# Altium schematic sheet CFD_V1.03_Main.SchDoc: ALICE FIT CFD Mezzanine
size 420 x 297 mm; CheckedBy: G.Kasprowicz; Author: INR Moscow; CompanyName: WUT ISE; DrawnBy: Maciej Podgóski; Organization: WUT ISE; Address1: PW ISE; Address2: Nowowiejska 15/19 00-665 Warsaw; Address3: gkasprow@gmail.com; DocumentNumber: 1; Revision: 2; SheetNumber: 1; SheetTotal: 5; ModifiedBy: -; CheckedDate: -; Title2: Top entity; DivGrp: WUT ISE; Designer: INR Moscow; ModifiedDate: -; ProjectName: Sensor Box
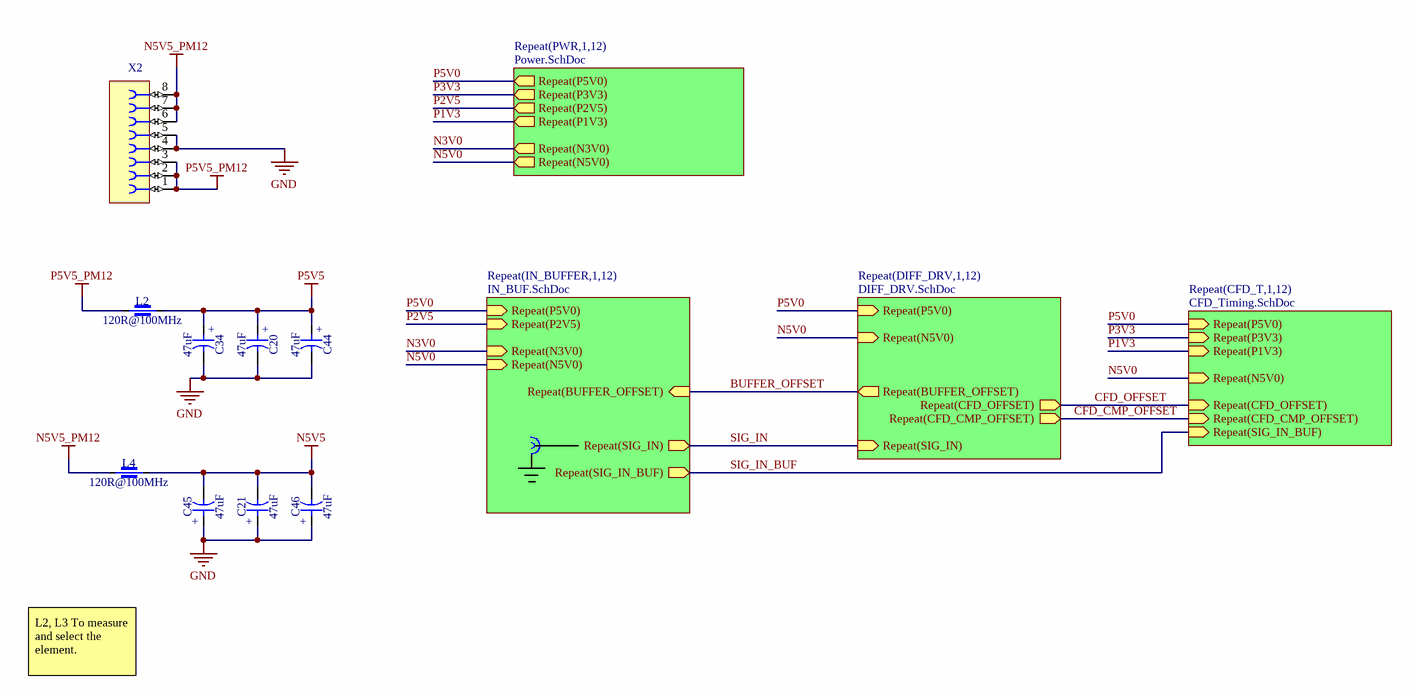
[diagram p0: CFD_V1.03_Main.SchDoc]

## Parts
C20  47uF  [CAPAE530X610N]
C21  47uF  [CAPAE530X610N]
C34  47uF  [CAPAE530X610N]
C44  47uF  [CAPAE530X610N]
C45  47uF  [CAPAE530X610N]
C46  47uF  [CAPAE530X610N]
L2  120R@100MHz  [IND_MURATA_BLM31KN]
L4  120R@100MHz  [IND_MURATA_BLM31KN]
X2  Socket 8  [SAMTEC_CES-108-01-T-S]  (value not drawn)

## Sub-sheets
Repeat(CFD_T,1,12) = CFD_Timing.SchDoc: Repeat(SIG_IN_BUF) (in), Repeat(CFD_CMP_OFFSET) (in), Repeat(P5V0) (in), Repeat(P3V3) (in), Repeat(P1V3) (in), Repeat(N5V0) (in), Repeat(CFD_OFFSET) (in)
Repeat(DIFF_DRV,1,12) = DIFF_DRV.SchDoc: Repeat(SIG_IN) (in), Repeat(BUFFER_OFFSET) (out), Repeat(CFD_CMP_OFFSET) (out), Repeat(P5V0) (in), Repeat(N5V0) (in), Repeat(CFD_OFFSET) (out)
Repeat(IN_BUFFER,1,12) = IN_BUF.SchDoc: Repeat(SIG_IN_BUF) (out), Repeat(SIG_IN) (out), Repeat(BUFFER_OFFSET) (in), Repeat(P5V0) (in), Repeat(P2V5) (in), Repeat(N5V0) (in), Repeat(N3V0) (in)
Repeat(PWR,1,12) = Power.SchDoc: Repeat(P5V0) (out), Repeat(P3V3) (out), Repeat(P2V5) (out), Repeat(P1V3) (out), Repeat(N3V0) (out), Repeat(N5V0) (out)

## Nets
GND: C20.2 C21.1 C34.2 C44.2 C45.1 C46.1 X2.4 X2.5
N5V5: C21.2 C45.2 C46.2 L4.2
N5V5_PM12: L4.1 X2.6 X2.7 X2.8
P5V5: C20.1 C34.1 C44.1 L2.2
P5V5_PM12: L2.1 X2.1 X2.2 X2.3
BUFFER_OFFSET: sheet Repeat(IN_BUFFER,1,12)/Repeat(BUFFER_OFFSET), sheet Repeat(DIFF_DRV,1,12)/Repeat(BUFFER_OFFSET)
CFD_CMP_OFFSET: sheet Repeat(DIFF_DRV,1,12)/Repeat(CFD_CMP_OFFSET), sheet Repeat(CFD_T,1,12)/Repeat(CFD_CMP_OFFSET)
CFD_OFFSET: sheet Repeat(DIFF_DRV,1,12)/Repeat(CFD_OFFSET), sheet Repeat(CFD_T,1,12)/Repeat(CFD_OFFSET)
N3V0: sheet Repeat(PWR,1,12)/Repeat(N3V0), sheet Repeat(IN_BUFFER,1,12)/Repeat(N3V0)
N5V0: sheet Repeat(PWR,1,12)/Repeat(N5V0), sheet Repeat(IN_BUFFER,1,12)/Repeat(N5V0), sheet Repeat(DIFF_DRV,1,12)/Repeat(N5V0), sheet Repeat(CFD_T,1,12)/Repeat(N5V0)
P1V3: sheet Repeat(PWR,1,12)/Repeat(P1V3), sheet Repeat(CFD_T,1,12)/Repeat(P1V3)
P2V5: sheet Repeat(PWR,1,12)/Repeat(P2V5), sheet Repeat(IN_BUFFER,1,12)/Repeat(P2V5)
P3V3: sheet Repeat(PWR,1,12)/Repeat(P3V3), sheet Repeat(CFD_T,1,12)/Repeat(P3V3)
P5V0: sheet Repeat(PWR,1,12)/Repeat(P5V0), sheet Repeat(IN_BUFFER,1,12)/Repeat(P5V0), sheet Repeat(DIFF_DRV,1,12)/Repeat(P5V0), sheet Repeat(CFD_T,1,12)/Repeat(P5V0)
SIG_IN: sheet Repeat(IN_BUFFER,1,12)/Repeat(SIG_IN), sheet Repeat(DIFF_DRV,1,12)/Repeat(SIG_IN)
SIG_IN_BUF: sheet Repeat(IN_BUFFER,1,12)/Repeat(SIG_IN_BUF), sheet Repeat(CFD_T,1,12)/Repeat(SIG_IN_BUF)

## Notes on the sheet
- L2, L3 To measure and select the element.
- Project/Equipment
- Document
- Designer
- Drawn by
- Check.by
- Copyright WUT ISE 2024.
  This documentation describes Open Hardware and is licensed under the CERN OHL v.2. You may redistribute and modify this documentation under the terms of the CERN OHL v.2. (http://ohwr.org/CERNOHL). This documentation is distributed WITHOUT ANY EXPRESS OR IMPLIED WARRANTY, INCLUDING OF MERCHANTABILITY, SATISFACTORY QUALITY AND FITNESS FOR A PARTICULAR PURPOSE. Please see the CERN OHL v.2 for applicable conditions.
- Contact
- File
- Last Mod.
- Print Date
- Sheet
- Size
- A3
- of
- Rev
- (in symbol CAE530-610_47UF_16V_20%) +

## Library data of the parts
C20 C21 C34 C44-C46 = CAE530-610_47UF_16V_20%: Polarised capacitor; Part Description: Conductive Polymer Hybrid Aluminum Electrolytic Capacitor; Manufacturer: CHEMI-CON; Manufacturer Part Number: HHXD160ARA470ME61G; Voltage: 16V; Tolerance: ±20%; Part Number: CAE530-610_47UF_16V_20%; Component Kind: Standard; Component Type: Standard; Pin Count: 2; Value: 47uF; Status: Not Recommended; Case: C; Mounted: Yes; Socket: No; SMD: Yes; Sense: No; ComponentHeight: 6.1mm; HelpURL: \\cern.ch\dfs\Applications\Altium\Datasheets\CAE_CHIMI-CON_HXD.pdf; Author: CERN DEM HF; CreateDate: 15.04.2024; LatestRevisionDate: 15.04.2024
L2 L4 = IND1206_MURATA_BLM31KN121SN1: Part Description: SMD Chip Ferrite Bead, BLM31KN_SN Series; Manufacturer: MURATA; Power: 6A; Resistance: 0.009R; Tolerance: ±25%; Part Number: IND1206_MURATA_BLM31KN121SN1; Component Kind: Standard; Component Type: Standard; Footprint: IND_MURATA_BLM31KN1; Pin Count: 2; Value: 120R@100MHz; Manufacturer Part Number: BLM31KN121SN1; Case: 1206; Mounted: Yes; Socket: No; SMD: Yes; Sense: No; ComponentHeight: 1.8mm; HelpURL: \\cern.ch\dfs\Applications\Altium\Datasheets\IND1206_MURATA_ BLM31KN_SN.pdf; Author: CERN DEM HF; CreateDate: 05.01.2022; LatestRevisionDate: 05.01.2022
X2 = SAMTEC_CES-108-01-L-S: Connector 8 Female; Part Description: 8 Contacts, Pitch 2.54mm, Single Row Through Mount Straight Socket (Lead Length 3.25mm); Manufacturer: SAMTEC; PressFit: No; Part Number: SAMTEC_CES-108-01-L-S; Component Kind: Standard; Component Type: Standard; Pin Count: 8; Family: Socket 8; Mounted: Yes; Socket: No; SMD: No; Sense: No; Status: None; Manufacturer Part Number: CES-108-01-L-S; ComponentHeight: 5.08mm; HelpURL: \\cern.ch\dfs\Applications\Altium\Datasheets\SAMTEC_CES-108-01-T-S.pdf; Author: CERN DEM HF; CreateDate: 25.04.2024; LatestRevisionDate: 25.04.2024